# EAGLE design Gravador 18F (EAGLE 6.2)
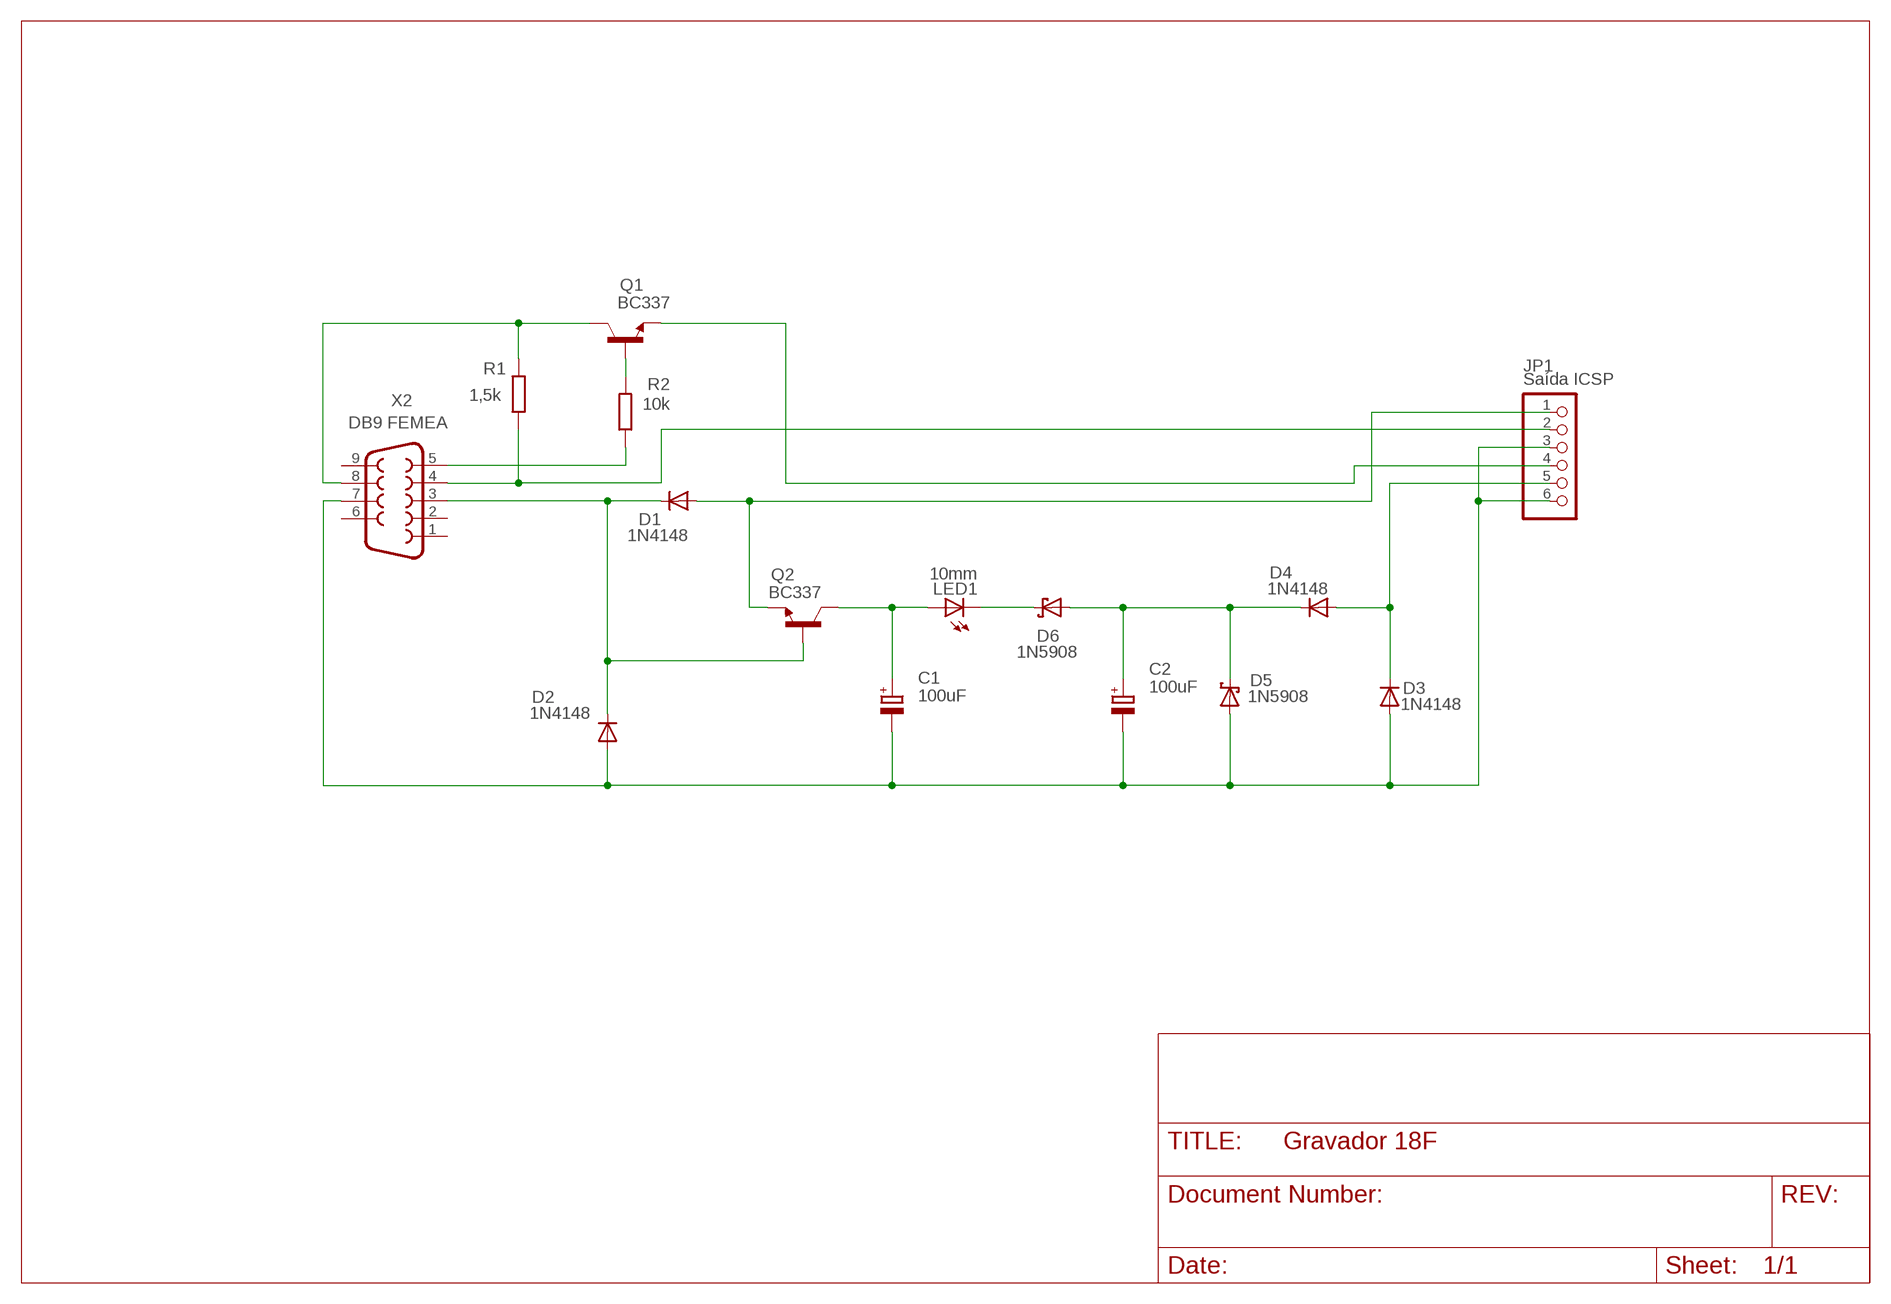
[diagram p0: schematic, sheet 1]

## Parts
C1  100uF  CPOL-EUE3.5-10  [E3,5-10]
C2  100uF  CPOL-EUE3.5-10  [E3,5-10]
D1  1N4148  1N4148DO35-7  [DO35-7]
D2  1N4148  1N4148DO35-7  [DO35-7]
D3  1N4148  1N4148DO35-7  [DO35-7]
D4  1N4148  1N4148DO35-7  [DO35-7]
D5  1N5908  [C4111-15]
D6  1N5908  [C4111-15]
JP1  Saída ICSP  PINHD-1X6  [1X06]
LED1  10mm  LED10MM  [LED10MM]
Q1  BC337  [TO92]
Q2  BC337  [TO92]
R1  1,5k  R-EU_0207/7  [0207/7]
R2  10k  R-EU_0207/7  [0207/7]
X2  DB9 FEMEA  F09HP  [F09HP]

## Nets
N$1: Q1.3(C) R1.2 X2.8
N$2: JP1.2 R1.1 X2.4
N$3: Q1.2(B) R2.2
N$4: R2.1 X2.5
N$5: C1.- C2.- D2.A D3.A D5.A JP1.3 JP1.6 X2.7
N$6: D1.C D2.C Q2.2(B) X2.3
N$7: C1.+ LED1.A Q2.3(C)
N$8: D1.A JP1.1 Q2.1(E)
N$10: D6.C LED1.K(C)
N$11: C2.+ D4.C D5.C D6.A
N$14: D3.C D4.A JP1.5
N$18: JP1.4 Q1.1(E)
Unconnected: X2.1 X2.2 X2.6 X2.9

## Notes on the sheet
- Vitor Ivan D'Angelo

## Library data of the parts
C1 C2 = rcl:CPOL-EU: POLARIZED CAPACITOR, European symbol
D1-D4 = diode:1N4148: DIODE high speed (Philips)
D5 D6 = diode:1N5908: DIODE schottky
JP1 = pinhead:PINHD-1X6: PIN HEADER
LED1 = led:LED: LED OSRAM: - CHIPLED LG R971, LG N971, LY N971, LG Q971, LY Q971, LO R971, LY R971 LH N974, LH R974 LS Q976, LO Q976, LY Q976 LO Q996 - Hyper CHIPLED LW Q18S LB Q993, LB Q99A, LB R99A - SideLED LS A670, LO A670, LY A670, LG A670, LP A670 LB A673, LV A673, LT A673, LW A673 LH A674 LY A675 LS A676, LA A676, LO A676, LY A676, LW A676 LS A679, LY A679, LG A679 - Hyper Micro SIDELED® LS Y876, LA Y876, LO Y876, LY Y876 LT Y87S - SmartLED LW L88C, LW L88S LB L89C, LB L89S, LG L890 LS L89K, LO L89K, LY L89K LS L896, LA L896, LO L896, LY L896 - TOPLED LS T670, LO T670, LY T670, LG T670, LP T670 LSG T670, LSP T670, LSY T670, LOP T670, LYG T670 LG T671, LOG T671, LSG T671 LB T673, LV T673, LT T673, LW T673 LH T674 LS T676, LA T676, LO T676, LY T676, LB T676, LH T676, LSB T676, LW T676 LB T67C, LV T67C, LT T67C, LS T67K, LO T67K, LY T67K, LW E67C LS E67B, LA E67B, LO E67B, LY E67B, LB E67C, LV E67C, LT E67C LW T67C LS T679, LY T679, LG T679 LS T770, LO T770, LY T770, LG T770, LP T770 LB T773, LV T773, LT T773, LW T773 LH T774 LS E675, LA E675, LY E675, LS T675 LS T776, LA T776, LO T776, LY T776, LB T776 LHGB T686 LT T68C, LB T68C - Hyper Mini TOPLED® LB M676 - Mini TOPLED Santana® LG M470 LS M47K, LO M47K, LY M47K Source: http://www.osram.convergy.de LUXEON: - LUMILED® LXK2-PW12-R00, LXK2-PW12-S00, LXK2-PW14-U00, LXK2-PW14-V00 LXK2-PM12-R00, LXK2-PM12-S00, LXK2-PM14-U00 LXK2-PE12-Q00, LXK2-PE12-R00, LXK2-PE12-S00, LXK2-PE14-T00, LXK2-PE14-U00 LXK2-PB12-K00, LXK2-PB12-L00, LXK2-PB12-M00, LXK2-PB14-N00, LXK2-PB14-P00, LXK2-PB14-Q00 LXK2-PR12-L00, LXK2-PR12-M00, LXK2-PR14-Q00, LXK2-PR14-R00 LXK2-PD12-Q00, LXK2-PD12-R00, LXK2-PD12-S00 LXK2-PH12-R00, LXK2-PH12-S00 LXK2-PL12-P00, LXK2-PL12-Q00, LXK2-PL12-R00 Source: www.luxeon.com KINGBRIGHT: KA-3528ASYC Source: www.kingbright.com
Q1 Q2 = transistor-npn:BC337*: NPN Transistor
R1 R2 = rcl:R-EU_: RESISTOR, European symbol
X2 = con-subd:F09: SUB-D; OC_FARNELL: unknown; OC_NEWARK: unknown

## Board
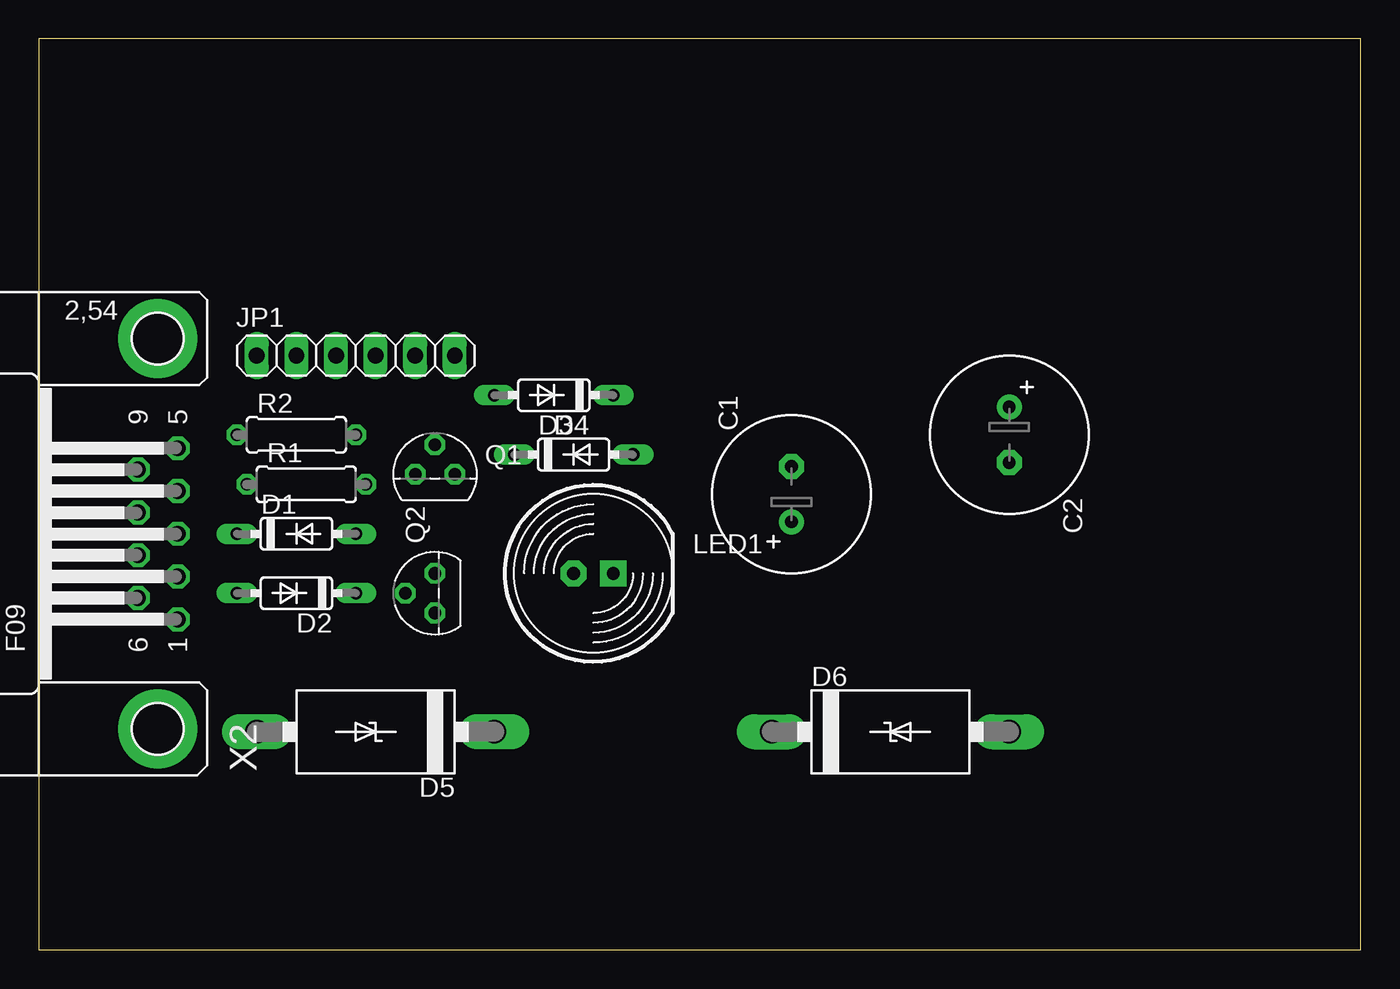
[diagram p1: board, top side]
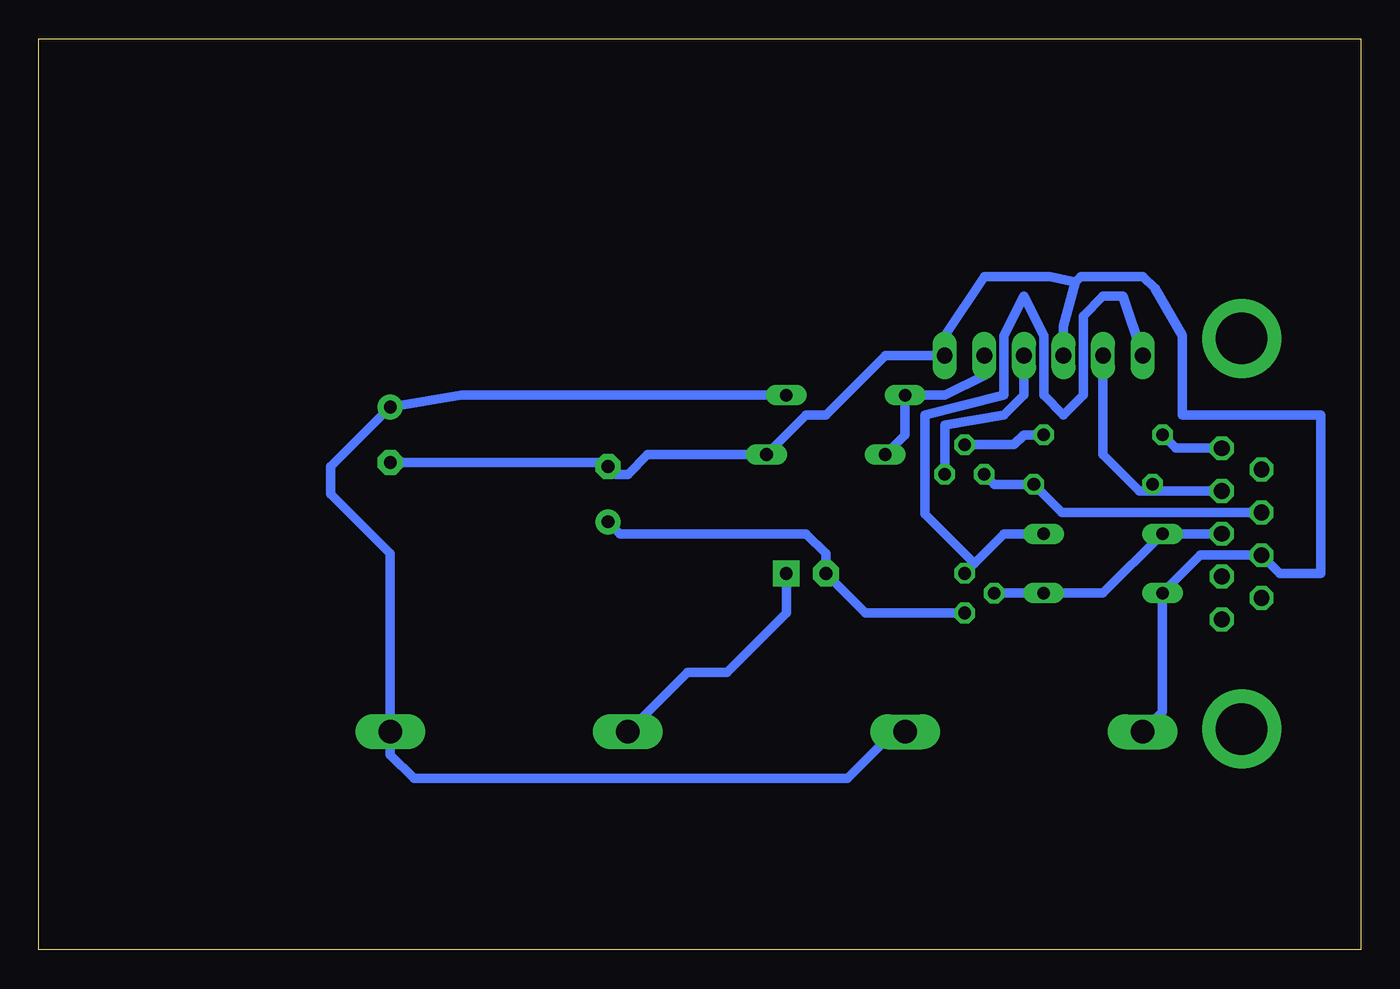
[diagram p2: board, bottom side, seen from below]

Size 84.76 x 58.41 mm. Coordinates in mm from the lower left corner, seen from the top.
Outline: 0,0 84.76,0 84.76,58.41 0,58.41 0,0
Copper layers (1*16): Top 0.035mm / dielectric 1.5mm / Bottom 0.035mm
Design rules: minimum track width 10mil, minimum drill 24mil, track to track 8mil, track to pad 8mil, pad to pad 8mil, via to via 8mil, smd to smd 8mil, copper to edge 40mil, drill to drill 8mil, minimum pad ring 10mil, minimum via ring 8mil, stop-mask expansion 4mil, vias tented up to drill 0mil, thermal gap 10mil

### Footprints (pad centres in the part's own frame; a part is rotated, then mirrored left to right if it is on the bottom)
E3,5-10 = drill 0.813 pad 1.6: + -1.778,0 | drill 0.813 pad 1.6 octagon: - 1.778,0
DO35-7 = drill 0.813 long: A 3.81,0; C -3.81,0
C4111-15 = drill 1.499 long: A 7.62,0; C -7.62,0
1X06 = drill 1.016 long: 1 -6.35,0; 2 -3.81,0; 3 -1.27,0; 4 1.27,0; 5 3.81,0; 6 6.35,0
LED10MM = drill 0.813 pad 1.676 octagon: A -1.27,0 | drill 0.813 pad 1.676 square: K 1.27,0
TO92 = drill 0.813 octagon: 1 1.27,0; 2 0,1.905; 3 -1.27,0
0207/7 = drill 0.813 octagon: 1 -3.81,0; 2 3.81,0
F09HP = drill 1.016 octagon: 1 -5.486,-1.27; 2 -2.743,-1.27; 3 0,-1.27; 4 2.743,-1.27; 5 5.486,-1.27; 6 -4.115,1.27; 7 -1.372,1.27; 8 1.372,1.27; 9 4.115,1.27 | drill 3.302 pad 5.08: G1 -12.522,0; G2 12.522,0

### Placement (x,y rotation side)
C1  48.26,29.21 90 top
C2  62.23,33.02 270 top
D1  16.51,26.67 0 top
D2  16.51,22.86 180 top
D3  34.29,31.75 0 top
D4  33.02,35.56 180 top
D5  21.59,13.97 180 top
D6  54.61,13.97 0 top
JP1  20.32,38.1 0 top
LED1  35.56,24.13 0 top
Q1  25.4,30.48 0 top
Q2  25.4,22.86 90 top
R1  17.14,29.84 0 top
R2  16.51,33.02 0 top
X2  7.62,26.67 90 top

### Tracks (layer width: path | path; a pad name or v marks a point on that pad's centre or on a via)
N$1
  Bottom 0.61: X2.8 19.15,28.04 R1.2 23.5,29.84 Q1.3
N$2
  Bottom 0.61: X2.4 12.9,29.41 | 12.9,29.41 R1.1 | 12.9,29.41 14.17,29.41 16.51,31.75 JP1.2
N$3
  Bottom 0.61: Q1.2 22.23,32.38 21.59,33.02 R2.2
N$4
  Bottom 0.61: X2.5 11.84,32.16 R2.1
N$5
  Bottom 0.61: D5.A 12.7,15.24 D2.A 10.26,25.3 X2.7 5.18,24.13 2.54,24.13 2.54,34.29 11.43,34.29 11.43,39.37 13.21,42.42 13.97,43.18 17.94,43.18 18.3,42.82 | C2.- 48.51,31.24 C1.- 47.75,30.48 46.99,30.48 45.72,31.75 D3.A 35.56,34.29 34.29,34.29 30.48,38.1 JP1.6 26.67,39.37 24.13,43.18 19.93,43.18 18.3,42.82 | JP1.3 19.05,39.98 18.3,42.82
N$6
  Bottom 0.61: X2.3 D1.C 16.51,22.86 D2.C Q2.2
N$7
  Bottom 0.61: Q2.3 31.75,21.59 LED1.A 34.29,25.4 35.56,26.67 47.5,26.67 C1.+
N$8
  Bottom 0.61: D1.A 22.86,26.67 24.77,24.77 | 24.77,24.77 Q2.1 | JP1.1 15.24,41.91 16.51,41.91 17.78,40.64 17.78,35.56 19.05,34.29 20.32,35.56 20.32,39.37 21.59,41.91 22.86,39.37 22.86,35.56 27.94,34.29 27.94,27.94 24.77,24.77
N$10
  Bottom 0.61: LED1.K 36.83,21.59 40.64,17.78 43.18,17.78 D6.C
N$11
  Bottom 0.61: D4.C 57.66,35.56 C2.+ 66.04,30.99 66.04,29.21 62.23,25.4 D6.A 62.23,12.5 60.71,10.97 32.92,10.97 29.79,14.1 29.34,14.1 D5.C
N$14
  Bottom 0.61: JP1.5 24.13,36.83 26.67,35.56 D4.A 29.21,33.02 D3.C
N$18
  Bottom 0.61: JP1.4 21.59,35.56 22.86,34.29 26.67,33.66 Q1.1